# Altium schematic sheet Main.SchDoc
size A4; SheetNumber: 1; SheetTotal: 1
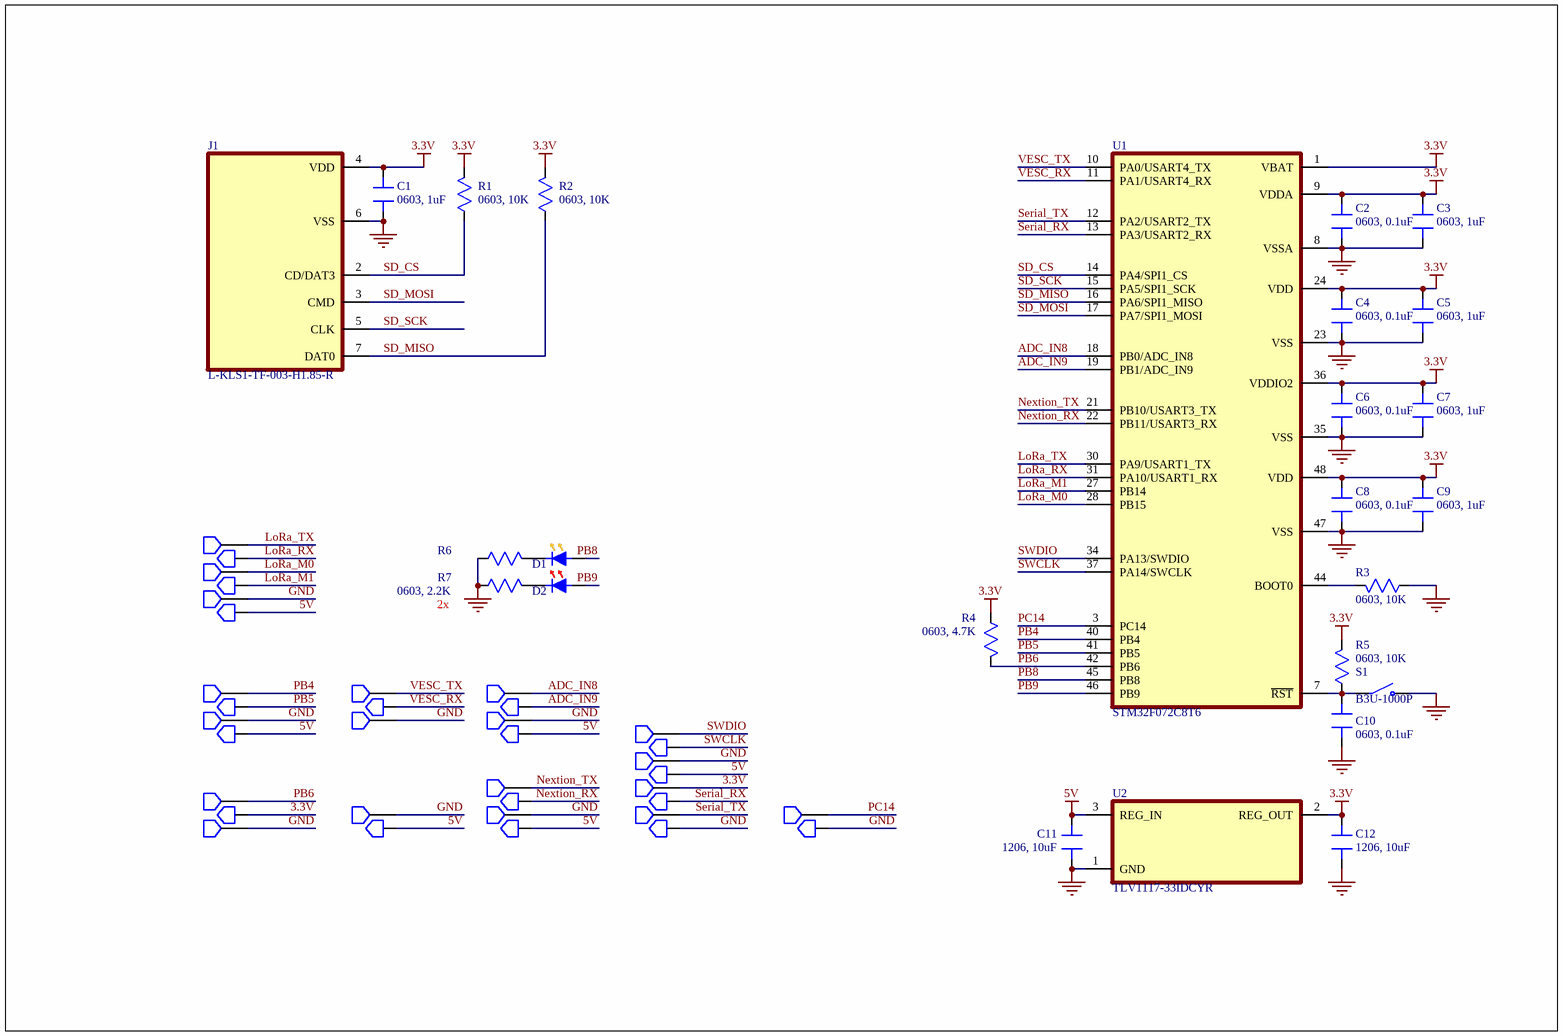
[diagram p0: Main.SchDoc]

## Parts
C1  0603, 1uF  [CAP 0603_1608]
C2  0603, 0.1uF  [CAP 0603_1608]
C3  0603, 1uF  [CAP 0603_1608]
C4  0603, 0.1uF  [CAP 0603_1608]
C5  0603, 1uF  [CAP 0603_1608]
C6  0603, 0.1uF  [CAP 0603_1608]
C7  0603, 1uF  [CAP 0603_1608]
C8  0603, 0.1uF  [CAP 0603_1608]
C9  0603, 1uF  [CAP 0603_1608]
C10  0603, 0.1uF  [CAP 0603_1608]
C11  1206, 10uF  [CAP 1206_3216]
C12  1206, 10uF  [CAP 1206_3216]
D1  0805 LED Yellow  [LED 0805_2012 YELLOW]  (value not drawn)
D2  0805 LED Red  [LED 0805_2012 RED]  (value not drawn)
J1  L-KLS1-TF-003-H1.85-R  [L-KLS1-TF-003-H1.85-R]
P1  Pad1  [PAD]  (value not drawn)  (no BOM)
P2  Pad0  [PAD]  (value not drawn)  (no BOM)
P3  Pad1  [PAD]  (value not drawn)  (no BOM)
P4  Pad0  [PAD]  (value not drawn)  (no BOM)
P5  Pad1  [PAD]  (value not drawn)  (no BOM)
P6  Pad0  [PAD]  (value not drawn)  (no BOM)
P7  Pad1  [PAD]  (value not drawn)  (no BOM)
P8  Pad1  [PAD]  (value not drawn)  (no BOM)
P9  Pad1  [PAD]  (value not drawn)  (no BOM)
P10  Pad0  [PAD]  (value not drawn)  (no BOM)
P11  Pad0  [PAD]  (value not drawn)  (no BOM)
P12  Pad0  [PAD]  (value not drawn)  (no BOM)
P13  Pad1  [PAD]  (value not drawn)  (no BOM)
P14  Pad1  [PAD]  (value not drawn)  (no BOM)
P15  Pad1  [PAD]  (value not drawn)  (no BOM)
P16  Pad0  [PAD]  (value not drawn)  (no BOM)
P17  Pad0  [PAD]  (value not drawn)  (no BOM)
P18  Pad1  [PAD]  (value not drawn)  (no BOM)
P19  Pad0  [PAD]  (value not drawn)  (no BOM)
P20  Pad1  [PAD]  (value not drawn)  (no BOM)
P21  Pad0  [PAD]  (value not drawn)  (no BOM)
P22  Pad1  [PAD]  (value not drawn)  (no BOM)
P23  Pad1  [PAD]  (value not drawn)  (no BOM)
P24  Pad1  [PAD]  (value not drawn)  (no BOM)
P25  Pad0  [PAD]  (value not drawn)  (no BOM)
P26  Pad0  [PAD]  (value not drawn)  (no BOM)
P27  Pad0  [PAD]  (value not drawn)  (no BOM)
P28  Pad1  [PAD]  (value not drawn)  (no BOM)
P29  Pad1  [PAD]  (value not drawn)  (no BOM)
P30  Pad1  [PAD]  (value not drawn)  (no BOM)
P31  Pad1  [PAD]  (value not drawn)  (no BOM)
P32  Pad0  [PAD]  (value not drawn)  (no BOM)
P33  Pad0  [PAD]  (value not drawn)  (no BOM)
P34  Pad0  [PAD]  (value not drawn)  (no BOM)
P35  Pad1  [PAD]  (value not drawn)  (no BOM)
P36  Pad0  [PAD]  (value not drawn)  (no BOM)
R1  0603, 10K  [RES 0603_1608]
R2  0603, 10K  [RES 0603_1608]
R3  0603, 10K  [RES 0603_1608]
R4  0603, 4.7K  [RES 0603_1608]
R5  0603, 10K  [RES 0603_1608]
R6  0603, 2.2K  [RES 0603_1608]  (value not drawn)
R7  0603, 2.2K  [RES 0603_1608]
S1  B3U-1000P  [B3U-1000P]
U1  STM32F072C8T6  [STM32F072C8T6]
U2  TLV1117-33IDCYR  [SOT230P700X180-4N]

## Nets
3.3V: C1.2 C2.2 C3.2 C4.2 C5.2 C6.2 C7.2 C8.2 C9.2 C12.2 J1.4(VDD) P23.1 P27.1 R1.1 R2.1 R4.1 R5.1 U1.1(VBAT) U1.9(VDDA) U1.24(VDD) U1.36(VDDIO2) U1.48(VDD) U2.2(REG_OUT)
5V: C11.2 P6.1 P16.1 P17.1 P21.1 P32.1 P33.1 U2.3(REG_IN)
GND: C1.1 C2.1 C3.1 C4.1 C5.1 C6.1 C7.1 C8.1 C9.1 C10.1 C11.1 C12.1 J1.6(VSS) P5.1 P13.1 P14.1 P15.1 P20.1 P28.1 P29.1 P31.1 P34.1 P36.1 R3.2 R6.1 R7.1 S1.2 U1.8(VSSA) U1.23(VSS) U1.35(VSS) U1.47(VSS) U2.1(GND)
ADC_IN8: P9.1 U1.18(PB0/ADC_IN8)
ADC_IN9: P12.1 U1.19(PB1/ADC_IN9)
LoRa_M0: P3.1 U1.28(PB15)
LoRa_M1: P4.1 U1.27(PB14)
LoRa_RX: P2.1 U1.31(PA10/USART1_RX)
LoRa_TX: P1.1 U1.30(PA9/USART1_TX)
Nextion_RX: P25.1 U1.22(PB11/USART3_RX)
Nextion_TX: P22.1 U1.21(PB10/USART3_TX)
PB4: P7.1 U1.40(PB4)
PB5: P10.1 U1.41(PB5)
PB6: P24.1 R4.2 U1.42(PB6)
PB8: D1.1 U1.45(PB8)
PB9: D2.1 U1.46(PB9)
PC14: P35.1 U1.3(PC14)
SD_CS: J1.2(CD/DAT3) R1.2 U1.14(PA4/SPI1_CS)
SD_MISO: J1.7(DAT0) R2.2 U1.16(PA6/SPI1_MISO)
SD_MOSI: J1.3(CMD) U1.17(PA7/SPI1_MOSI)
SD_SCK: J1.5(CLK) U1.15(PA5/SPI1_SCK)
Serial_RX: P26.1 U1.13(PA3/USART2_RX)
Serial_TX: P30.1 U1.12(PA2/USART2_TX)
SWCLK: P19.1 U1.37(PA14/SWCLK)
SWDIO: P18.1 U1.34(PA13/SWDIO)
VESC_RX: P11.1 U1.11(PA1/USART4_RX)
VESC_TX: P8.1 U1.10(PA0/USART4_TX)
NetC10_2: C10.2 R5.2 S1.1 U1.7(~{RST})
NetD1_2: D1.2 R6.2
NetD2_2: D2.2 R7.2
NetR3_1: R3.1 U1.44(BOOT0)

## Notes on the sheet
- 2x

## Library data of the parts
C1-C10 = 0603 Kapasitör
C11 C12 = 1206 Kapasitör
R1-R7 = 0603 Direnç